# Altium schematic sheet User Interface.SchDoc
size 406 x 304 mm; SheetNumber: 14; SheetTotal: 14
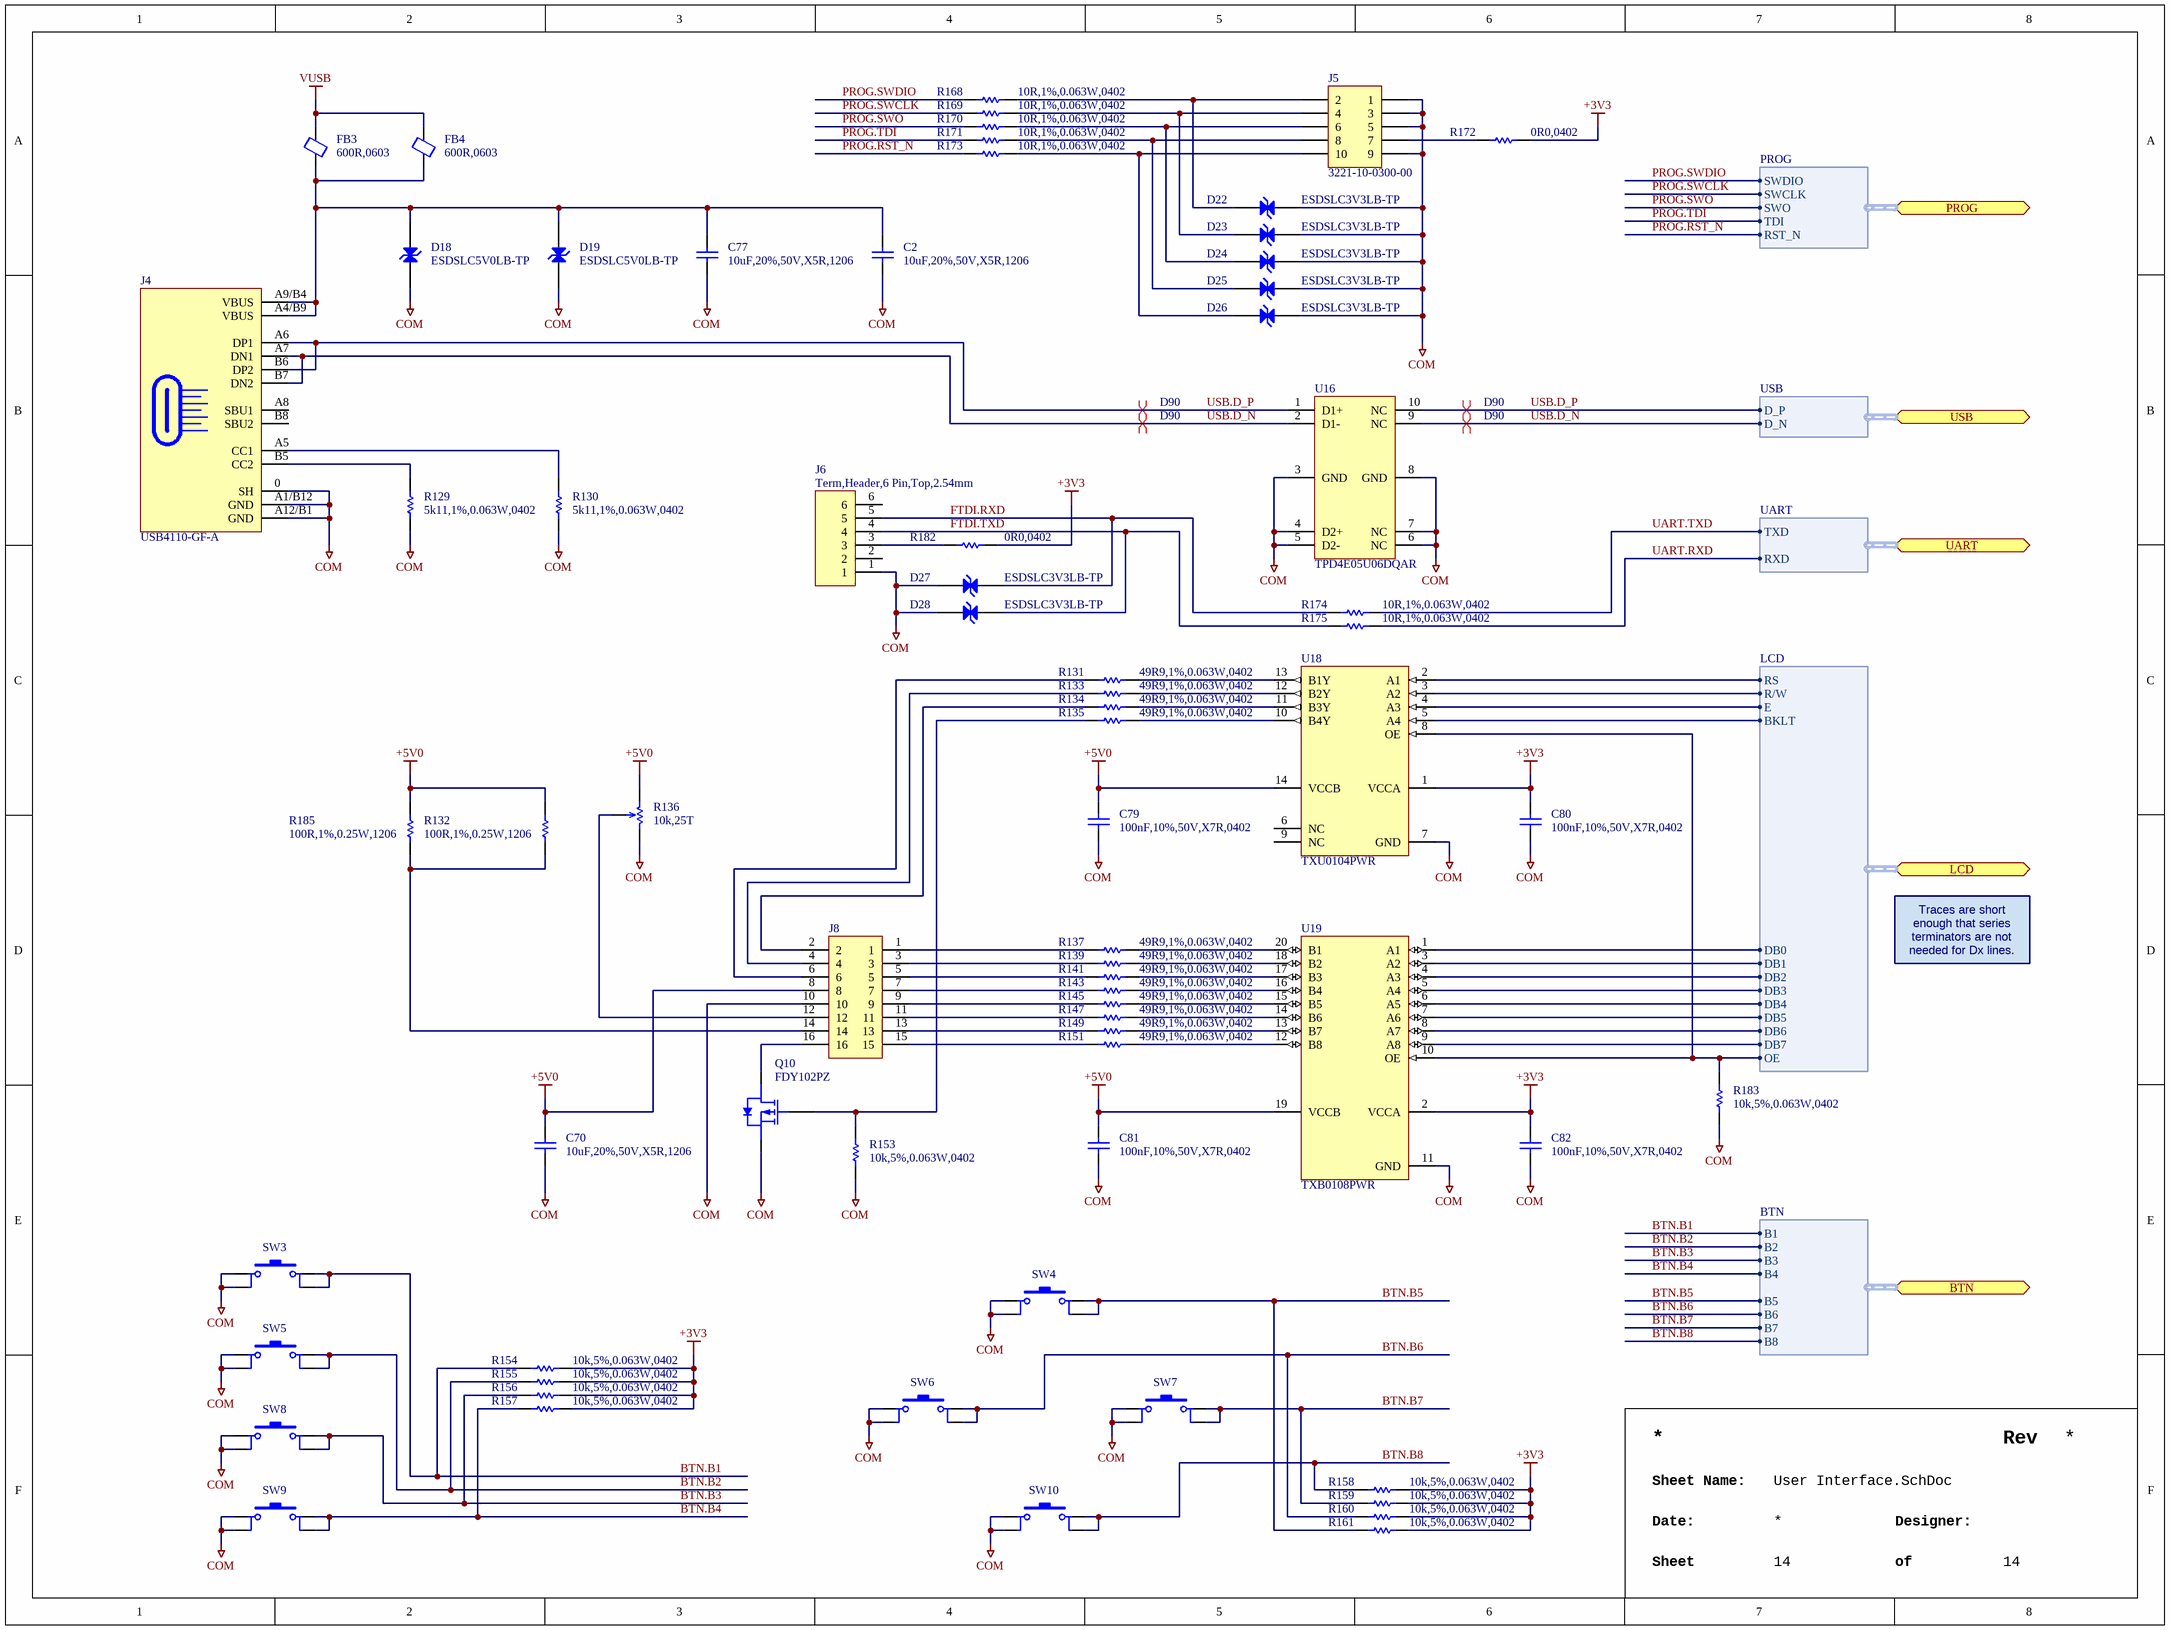
[diagram p0: User Interface.SchDoc]

## Parts
C2  10uF,20%,50V,X5R,1206  [CAPC3216X16N]
C70  10uF,20%,50V,X5R,1206  [CAPC3216X16N]
C77  10uF,20%,50V,X5R,1206  [CAPC3216X16N]
C79  100nF,10%,50V,X7R,0402  [CAPC1005X06N]
C80  100nF,10%,50V,X7R,0402  [CAPC1005X06N]
C81  100nF,10%,50V,X7R,0402  [CAPC1005X06N]
C82  100nF,10%,50V,X7R,0402  [CAPC1005X06N]
D18  ESDSLC5V0LB-TP  [MICROCOMMERCIAL_DFN1006-2_NPOL]
D19  ESDSLC5V0LB-TP  [MICROCOMMERCIAL_DFN1006-2_NPOL]
D22  ESDSLC3V3LB-TP  [DFN65P100X50-2N]
D23  ESDSLC3V3LB-TP  [DFN65P100X50-2N]
D24  ESDSLC3V3LB-TP  [DFN65P100X50-2N]
D25  ESDSLC3V3LB-TP  [DFN65P100X50-2N]
D26  ESDSLC3V3LB-TP  [DFN65P100X50-2N]
D27  ESDSLC3V3LB-TP  [DFN65P100X50-2N]
D28  ESDSLC3V3LB-TP  [DFN65P100X50-2N]
FB3  600R,0603  [INDC_0603]
FB4  600R,0603  [INDC_0603]
J4  USB4110-GF-A  [GCT_USB4110-GF-A]
J5  3221-10-0300-00  [CNC Tech_3221-10-0300-00]
J6  Term,Header,6 Pin,Top,2.54mm  [WURTH_61300611121]
J8  PPPC082LFBN-RC  [SULLINS_PPPC082LFBN-RC]  (value not drawn)
Q10  FDY102PZ  [ONSEMI_SC-89]
R129  5k11,1%,0.063W,0402  [RESC1005X04N]
R130  5k11,1%,0.063W,0402  [RESC1005X04N]
R131  49R9,1%,0.063W,0402  [RESC1005X04N]
R132  100R,1%,0.25W,1206  [SEI_PKG_RMCF1206]
R133  49R9,1%,0.063W,0402  [RESC1005X04N]
R134  49R9,1%,0.063W,0402  [RESC1005X04N]
R135  49R9,1%,0.063W,0402  [RESC1005X04N]
R136  10k,25T  [BOURNS_3296W]
R137  49R9,1%,0.063W,0402  [RESC1005X04N]
R139  49R9,1%,0.063W,0402  [RESC1005X04N]
R141  49R9,1%,0.063W,0402  [RESC1005X04N]
R143  49R9,1%,0.063W,0402  [RESC1005X04N]
R145  49R9,1%,0.063W,0402  [RESC1005X04N]
R147  49R9,1%,0.063W,0402  [RESC1005X04N]
R149  49R9,1%,0.063W,0402  [RESC1005X04N]
R151  49R9,1%,0.063W,0402  [RESC1005X04N]
R153  10k,5%,0.063W,0402  [RESC1005X04N]
R154  10k,5%,0.063W,0402  [RESC1005X04N]
R155  10k,5%,0.063W,0402  [RESC1005X04N]
R156  10k,5%,0.063W,0402  [RESC1005X04N]
R157  10k,5%,0.063W,0402  [RESC1005X04N]
R158  10k,5%,0.063W,0402  [RESC1005X04N]
R159  10k,5%,0.063W,0402  [RESC1005X04N]
R160  10k,5%,0.063W,0402  [RESC1005X04N]
R161  10k,5%,0.063W,0402  [RESC1005X04N]
R168  10R,1%,0.063W,0402  [RESC1005X04N]
R169  10R,1%,0.063W,0402  [RESC1005X04N]
R170  10R,1%,0.063W,0402  [RESC1005X04N]
R171  10R,1%,0.063W,0402  [RESC1005X04N]
R172  0R0,0402  [RESC1005X04N]
R173  10R,1%,0.063W,0402  [RESC1005X04N]
R174  10R,1%,0.063W,0402  [RESC1005X04N]
R175  10R,1%,0.063W,0402  [RESC1005X04N]
R182  0R0,0402  [RESC1005X04N]
R183  10k,5%,0.063W,0402  [RESC1005X04N]
R185  100R,1%,0.25W,1206  [SEI_PKG_RMCF1206]
SW3  PTS645SK43SMTR92 LFS  [C&K_PTS645SK43SMTR92 LFS]  (value not drawn)
SW4  PTS645SK43SMTR92 LFS  [C&K_PTS645SK43SMTR92 LFS]  (value not drawn)
SW5  PTS645SK43SMTR92 LFS  [C&K_PTS645SK43SMTR92 LFS]  (value not drawn)
SW6  PTS645SK43SMTR92 LFS  [C&K_PTS645SK43SMTR92 LFS]  (value not drawn)
SW7  PTS645SK43SMTR92 LFS  [C&K_PTS645SK43SMTR92 LFS]  (value not drawn)
SW8  PTS645SK43SMTR92 LFS  [C&K_PTS645SK43SMTR92 LFS]  (value not drawn)
SW9  PTS645SK43SMTR92 LFS  [C&K_PTS645SK43SMTR92 LFS]  (value not drawn)
SW10  PTS645SK43SMTR92 LFS  [C&K_PTS645SK43SMTR92 LFS]  (value not drawn)
U16  TPD4E05U06DQAR  [TEXASINSTRUMENTS_PKG_DQA0009A]
U18  TXU0104PWR  [SOP65P640X120-14N]
U19  TXB0108PWR  [TEXASINSTRUMENTS_PKG_PW0020A]

## Ports
BTN (bidir, harness BTN), LCD (bidir, harness LCD), PROG (bidir, harness PROG), UART (bidir, harness UART), USB (bidir, harness USB)

## Harnesses
USB: D_P, D_N
LCD: RS, R/W, E, BKLT, DB0, DB1, DB2, DB3, DB4, DB5, DB6, DB7, OE
BTN: B1, B2, B3, B4, B5, B6, B7, B8
UART: TXD, RXD
PROG: SWDIO, SWCLK, SWO, TDI, RST_N

## Nets
+3V3: C80.2 C82.2 R154.2 R155.2 R156.2 R157.2 R158.2 R159.2 R160.2 R161.2 R172.2 R182.2 U18.1(VCCA) U19.2(VCCA)
+5V0: C70.2 C79.2 C81.2 J8.8 R132.2 R136.3 R185.2 U18.14(VCCB) U19.19(VCCB)
COM: C2.1 C70.1 C77.1 C79.1 C80.1 C81.1 C82.1 D18.2(A) D19.2(A) D22.1(K) D23.1(K) D24.1(K) D25.1(K) D26.1(K) D27.2(A) D28.2(A) J4.0(SH) J4.A1/B12(GND) J4.A12/B1(GND) J5.1 J5.3 J5.5 J5.9 J6.1 J8.10 Q10.2(S) R129.1 R130.1 R136.1 R153.1 R183.1 SW3.1 SW3.2 SW4.1 SW4.2 SW5.1 SW5.2 SW6.1 SW6.2 SW7.1 SW7.2 SW8.1 SW8.2 SW9.1 SW9.2 SW10.1 SW10.2 U16.3(GND) U16.4(D2+) U16.5(D2-) U16.6(NC) U16.7(NC) U16.8(GND) U18.7(GND) U19.11(GND)
VUSB: FB3.2 FB4.2
BTN.B1: R154.1 SW3.3 SW3.4 ; port BTN.B1
BTN.B2: R155.1 SW5.3 SW5.4 ; port BTN.B2
BTN.B3: R156.1 SW8.3 SW8.4 ; port BTN.B3
BTN.B4: R157.1 SW9.3 SW9.4 ; port BTN.B4
BTN.B5: R161.1 SW4.3 SW4.4 ; port BTN.B5
BTN.B6: R160.1 SW6.3 SW6.4 ; port BTN.B6
BTN.B7: R159.1 SW7.3 SW7.4 ; port BTN.B7
BTN.B8: R158.1 SW10.3 SW10.4 ; port BTN.B8
FTDI.RXD: D27.1(K) J6.5 R174.1
FTDI.TXD: D28.1(K) J6.4 R175.1
PROG.RST_N: R173.1 ; port PROG.RST_N
PROG.SWCLK: R169.1 ; port PROG.SWCLK
PROG.SWDIO: R168.1 ; port PROG.SWDIO
PROG.SWO: R170.1 ; port PROG.SWO
PROG.TDI: R171.1 ; port PROG.TDI
UART.RXD: R175.2 ; port UART.RXD
UART.TXD: R174.2 ; port UART.TXD
USB.D_N: J4.A7(DN1) J4.B7(DN2) U16.2(D1-) U16.9(NC) ; port USB.D_N
USB.D_P: J4.A6(DP1) J4.B6(DP2) U16.1(D1+) U16.10(NC) ; port USB.D_P
NetC2_2: C2.2 C77.2 D18.1(K) D19.1(K) FB3.1 FB4.1 J4.A4/B9(VBUS) J4.A9/B4(VBUS)
NetD22_2: D22.2(A) J5.2 R168.2
NetD23_2: D23.2(A) J5.4 R169.2
NetD24_2: D24.2(A) J5.6 R170.2
NetD25_2: D25.2(A) J5.8 R171.2
NetD26_2: D26.2(A) J5.10 R173.2
NetJ4_A5: J4.A5(CC1) R130.2
NetJ4_B5: J4.B5(CC2) R129.2
NetJ5_7: J5.7 R172.1
NetJ6_3: J6.3 R182.1
NetJ8_1: J8.1 R137.1
NetJ8_2: J8.2 R134.1
NetJ8_3: J8.3 R139.1
NetJ8_4: J8.4 R133.1
NetJ8_5: J8.5 R141.1
NetJ8_6: J8.6 R131.1
NetJ8_7: J8.7 R143.1
NetJ8_9: J8.9 R145.1
NetJ8_11: J8.11 R147.1
NetJ8_12: J8.12 R136.2
NetJ8_13: J8.13 R149.1
NetJ8_14: J8.14 R132.1 R185.1
NetJ8_15: J8.15 R151.1
NetJ8_16: J8.16 Q10.3(D)
NetQ10_1: Q10.1(G) R135.1 R153.2
NetR131_2: R131.2 U18.13(B1Y)
NetR133_2: R133.2 U18.12(B2Y)
NetR134_2: R134.2 U18.11(B3Y)
NetR135_2: R135.2 U18.10(B4Y)
NetR137_2: R137.2 U19.20(B1)
NetR139_2: R139.2 U19.18(B2)
NetR141_2: R141.2 U19.17(B3)
NetR143_2: R143.2 U19.16(B4)
NetR145_2: R145.2 U19.15(B5)
NetR147_2: R147.2 U19.14(B6)
NetR149_2: R149.2 U19.13(B7)
NetR151_2: R151.2 U19.12(B8)
NetR183_2: R183.2 U18.8(OE) U19.10(OE) ; port LCD.OE
NetU18_2: U18.2(A1) ; port LCD.RS
NetU18_3: U18.3(A2) ; port LCD.R/W
NetU18_4: U18.4(A3) ; port LCD.E
NetU18_5: U18.5(A4) ; port LCD.BKLT
NetU19_1: U19.1(A1) ; port LCD.DB0
NetU19_3: U19.3(A2) ; port LCD.DB1
NetU19_4: U19.4(A3) ; port LCD.DB2
NetU19_5: U19.5(A4) ; port LCD.DB3
NetU19_6: U19.6(A5) ; port LCD.DB4
NetU19_7: U19.7(A6) ; port LCD.DB5
NetU19_8: U19.8(A7) ; port LCD.DB6
NetU19_9: U19.9(A8) ; port LCD.DB7

Not connected (* = marked no-connect by the designer): J4 A8(SBU1) B8(SBU2); J6 2 6; U18 6(NC) 9(NC)

## Layout directives
differential pair; differential pair class D90: USB.D_N, USB.D_P

## Notes on the sheet
- Traces are short enough that series terminators are not needed for Dx lines.
- Rev
- Sheet Name:
- Date:
- Sheet
- Designer:
- of

## Library data of the parts
C2 C70 C77 = CAP,Cer,10uF,50VDC,X5R,1206: 10ï¿½F ï¿½20% 50V Ceramic Capacitor X5R 1206 (3216 Metric); Manufacturer 1: Samsung Electro-Mechanics; Manufacturer 1 Part Number: CL31A106MBHNNNE; Vendor 1 Part Number: 1276-6736-1-ND; Vendor 1: Digikey; Value: 10u; Part Name: CAP,Cer,10uF,50VDC,X5R,1206; CreatedBy: Judd Foster; HelpURL: https://www.samsungsem.com/resources/file/global/support/product_catalog/MLCC.pdf
C79-C82 = CAP,Cer,100nF,10%,50V,X7R,0402: 50V 100nF X7R Â±10% 0402 Ceramic Capacitors ROHS; Manufacturer 1: Murata; Manufacturer 1 Part Number: GRM155R71H104KE14D; Vendor 1 Part Number: C77020; Vendor 1: LCSC; Value: 100n; Part Name: CAP,Cer,100nF,10%,50V,X7R,0402; CreatedBy: Judd Foster; HelpURL: https://www.lcsc.com/datasheet/C77020.pdf
D18 D19 = DIODE,TVS,5.0V,SOD882: 20V Clamp 4A (8/20ï¿½s) Ipp Tvs Diode Surface Mount 2-DFN1006; Manufacturer 1: Micro Commercial Co; Vendor 1 Part Number: ESDSLC5V0LB-TPMSCT-ND; Vendor 1: Digikey; Part Name: DIODE,TVS,5.0V,SOD882; CreatedBy: Judd Foster; HelpURL: https://www.mccsemi.com/pdf/Products/ESDSLC5V0LB(DFN1006-2).pdf; Manufacturer 1 Part Number: ESDSLC5V0LB-TP
D22-D28 = DIODE,TVS,3.3V,SOD882: 20V Clamp 5A (8/20ï¿½s) Ipp Tvs Diode Surface Mount DFN1006-2; Manufacturer 1: Micro Commercial Co; Vendor 1 Part Number: ESDSLC3V3LB-TPMSCT-ND; Vendor 1: Digikey; Part Name: DIODE,TVS,3.3V,SOD882; CreatedBy: Judd Foster; HelpURL: https://www.mccsemi.com/pdf/Products/ESDSLC3V3LB(DFN1006-2).pdf; Manufacturer 1 Part Number: ESDSLC3V3LB-TP
FB3 FB4 = FERRITE,600R@100MHz,350mA,0603: 500mÎ© Â±25% 600Î©@100MHz 0603 Ferrite Beads and Chips ROHS; Manufacturer 1: TAI-TECH; Manufacturer 1 Part Number: FCM1608KF-601T03; Vendor 1 Part Number: C141723; Vendor 1: LCSC; Part Name: FERRITE,600R@100MHz,350mA,0603; CreatedBy: Judd Foster; HelpURL: https://www.lcsc.com/datasheet/C141723.pdf
J4 = Conn,USB-C,SMD: USB-C (USB TYPE-C) USB 2.0 Receptacle Connector 24 (16+8 Dummy) Position Surface Mount, Right Angle; Manufacturer 1: GCT; Vendor 1 Part Number: 2073-USB4110-GF-A-1-ND; Vendor 1: Digikey; Part Name: Conn,USB-C,SMD; CreatedBy: Judd Foster; HelpURL: https://gct.co/files/drawings/usb4110.pdf; Manufacturer 1 Part Number: USB4110-GF-A
J5 = Term,Header,5x2 Pin,Shroud,1.27mm,SMD: Connector Header Surface Mount 10 position 0.050" (1.27mm); Manufacturer 1: CNC Tech; Vendor 1 Part Number: 1175-1735-ND; Vendor 1: Digikey; Part Name: Term,Header,5x2 Pin,Shroud,1.27mm,SMD; CreatedBy: Judd Foster; HelpURL: http://www.cnctech.us/pdfs/3221-XX-0300-00_.pdf; Manufacturer 1 Part Number: 3221-10-0300-00
J6 = Term,Header,6 Pin,Top,2.54mm: Connector Header Through Hole 6 position 0.100" (2.54mm); Manufacturer 1: WÃ¼rth Elektronik; Manufacturer 1 Part Number: 61300611121; Vendor 1 Part Number: 732-5319-ND; Vendor 1: DigiKey; Part Name: Term,Header,6 Pin,Top,2.54mm; CreatedBy: Judd Foster; HelpURL: https://www.we-online.com/components/products/datasheet/61300611121.pdf
J8 = Term,Rcpt,2x8 Pin,2.54mm,Top,Thru: 16 Position Header Connector 0.100" (2.54mm) Through Hole Gold; Manufacturer 1: Sullins Connector Solutions; Vendor 1 Part Number: S7111-ND; Vendor 1: DigiKey; Part Name: Term,Rcpt,2x8 Pin,2.54mm,Top,Thru; CreatedBy: Judd Foster; HelpURL: https://mm.digikey.com/Volume0/opasdata/d220001/medias/docus/937/Female_Headers.100_DS.pdf; Manufacturer 1 Part Number: PPPC082LFBN-RC
Q10 = MOSFET,P Ch,20V,830mA: P-Channel 20 V 830mA (Ta) 625mW (Ta) Surface Mount SC-89-3; Manufacturer 1: onsemi; Vendor 1 Part Number: FDY102PZCT-ND; Vendor 1: Digikey; Part Name: MOSFET,P Ch,20V,830mA; CreatedBy: Judd Foster; HelpURL: https://rocelec.widen.net/view/pdf/hh954mlmw6/FAIR-S-A0000083184-1.pdf?t.download=true&u=5oefqw; Manufacturer 1 Part Number: FDY102PZ
R129 R130 = RES,5k11,1%,0.063W,0402: 5.11 kOhms ï¿½1% 0.063W, 1/16W Chip Resistor 0402 (1005 Metric) Automotive AEC-Q200, Moisture Resistant Thick Film; Manufacturer 1: Yageo; Manufacturer 1 Part Number: AC0402FR-075K11L; Vendor 1 Part Number: 13-AC0402FR-075K11LCT-ND; Vendor 1: Digikey; Part Name: RES,5k11,1%,0.063W,0402; CreatedBy: Judd Foster; HelpURL: https://www.yageo.com/upload/media/product/productsearch/datasheet/rchip/PYu-AC_51_RoHS_L_7.pdf; Value: 5k11
R131 R133-R135 R137 R139 R141 R143 R145 R147 R149 R151 = RES,49R9,1%,0.063W,0402: 49.9 Ohms Â±1% 0.063W, 1/16W Chip Resistor 0402 (1005 Metric) Moisture Resistant Thick Film; Manufacturer 1: YAGEO; Manufacturer 1 Part Number: RC0402FR-0749R9L; Vendor 1 Part Number: 311-49.9LRCT-ND; Vendor 1: DigiKey; Value: 49.9; Part Name: RES,49R9,1%,0.063W,0402; CreatedBy: Judd Foster; HelpURL: https://www.yageo.com/upload/media/product/products/datasheet/rchip/PYu-RC_Group_51_RoHS_L_12.pdf
R132 R185 = RES,100R,1%,0.25W,1206: 100 Ohms Â±1% 0.25W, 1/4W Chip Resistor 1206 (3216 Metric) Automotive AEC-Q200 Thick Film; Manufacturer 1: Stackpole Electronics Inc; Manufacturer 1 Part Number: RMCF1206FT100R; Vendor 1 Part Number: RMCF1206FT100RCT-ND; Vendor 1: DigiKey; Part Name: RES,100R,1%,0.25W,1206; CreatedBy: Judd Foster; HelpURL: https://www.seielect.com/catalog/sei-rmcf_rmcp.pdf; Value: 100R
R136 = RES,Trimmer,25T,10k,Thru: Â±10% Â±100ppm/â„ƒ 500mW 10kÎ© SIP-3P,9.5x4.8mm Trimmer Potentiometers ROHS; Manufacturer 1: Bourns; Manufacturer 1 Part Number: 3296W-1-103LF; Vendor 1 Part Number: C34846; Vendor 1: LCSC; Part Name: RES,Trimmer,25T,10k,Thru; CreatedBy: Judd Foster; HelpURL: https://www.lcsc.com/datasheet/C34846.pdf
R153-R161 R183 = RES,10k,5%,0.063W,0402: 10 kOhms ï¿½5% 0.063W, 1/16W Chip Resistor 0402 (1005 Metric) Automotive AEC-Q200 Thick Film; Manufacturer 1: Stackpole Electronics Inc; Manufacturer 1 Part Number: RMCF0402JT10K0; Vendor 1 Part Number: RMCF0402JT10K0CT-ND; Vendor 1: DIgikey; Part Name: RES,10k,5%,0.063W,0402; CreatedBy: Judd Foster; HelpURL: https://www.seielect.com/catalog/sei-rmcf_rmcp.pdf; Value: 10k
R168-R171 R173-R175 = RES,10R,1%,0.063W,0402: 10 Ohms ï¿½1% 0.063W, 1/16W Chip Resistor 0402 (1005 Metric) Automotive AEC-Q200 Thick Film; Manufacturer 1: Panasonic Electronic Components; Manufacturer 1 Part Number: ERJ-2RKF10R0X; Vendor 1 Part Number: P10.0LCT-ND; Vendor 1: Digikey; Value: 10; Part Name: RES,10R,1%,0.063W,0402; CreatedBy: Judd Foster; HelpURL: https://industrial.panasonic.com/cdbs/www-data/pdf/RDA0000/AOA0000C304.pdf
R172 R182 = RES,0R0,0402: 0 Ohms Jumper 0.1W, 1/10W Chip Resistor 0402 (1005 Metric) Automotive AEC-Q200 Thick Film; Manufacturer 1: Panasonic Electronic Components; Manufacturer 1 Part Number: ERJ-2GE0R00X; Vendor 1 Part Number: P0.0JCT-ND; Vendor 1: Digikey; Value: 0; Part Name: RES,0R0,0402; CreatedBy: Judd Foster; HelpURL: https://industrial.panasonic.com/cdbs/www-data/pdf/RDA0000/AOA0000C301.pdf
SW3-SW10 = Switch,Tactile,SPST-NO,SMD,H4.3: Tactile Switch SPST-NO Top Actuated Surface Mount; Manufacturer 1: C&K; Vendor 1 Part Number: CKN9084CT-ND; Vendor 1: Digikey; Part Name: Switch,Tactile,SPST-NO,SMD,H4.3; CreatedBy: Judd Foster; HelpURL: https://www.ckswitches.com/media/1471/pts645.pdf; Manufacturer 1 Part Number: PTS645SK43SMTR92 LFS
U16 = TPD4E05U06DQAR: 2.5A@8/20us 14V 40W@8/20us 6.5V Unidirectional 5.5V USON-10(1x2.5) TVS Diodes ROHS; Manufacturer 1: Texas Instruments; Vendor 1 Part Number: C138714; Vendor 1: LCSC; Part Name: TPD4E05U06DQAR; CreatedBy: Judd Foster; HelpURL: https://www.lcsc.com/datasheet/C138714.pdf; Manufacturer 1 Part Number: TPD4E05U06DQAR
U18 = TXU0104PWR: General Purpose Amplifier Circuit Rail-to-Rail 8-VSSOP; Manufacturer 1: Texas Instruments; Vendor 1 Part Number: 296-TXU0104PWRCT-ND; Vendor 1: Digikey; Part Name: TXU0104PWR; CreatedBy: Judd Foster; HelpURL: http://www.ti.com/general/docs/suppproductinfo.tsp?distId=10&gotoUrl=http%3A%2F%2Fwww.ti.com%2Flit%2Fgpn%2FTXU0104; Manufacturer 1 Part Number: TXU0104PWR
U19 = TXB0108PWR: 100Mbps 1 8 TSSOP-20 Translators, Level Shifters ROHS; Manufacturer 1: Texas Instruments; Vendor 1 Part Number: C53406; Vendor 1: LCSC; Part Name: TXB0108PWR; CreatedBy: Judd Foster; HelpURL: https://www.lcsc.com/datasheet/C53406.pdf; Manufacturer 1 Part Number: TXB0108PWR